# Altium schematic sheet RFID.SchDoc: RFID
size 420 x 297 mm; DrawnBy: Hung Vo; SheetNumber: 2; SheetTotal: 4; MasterProject: BTL TKHTN
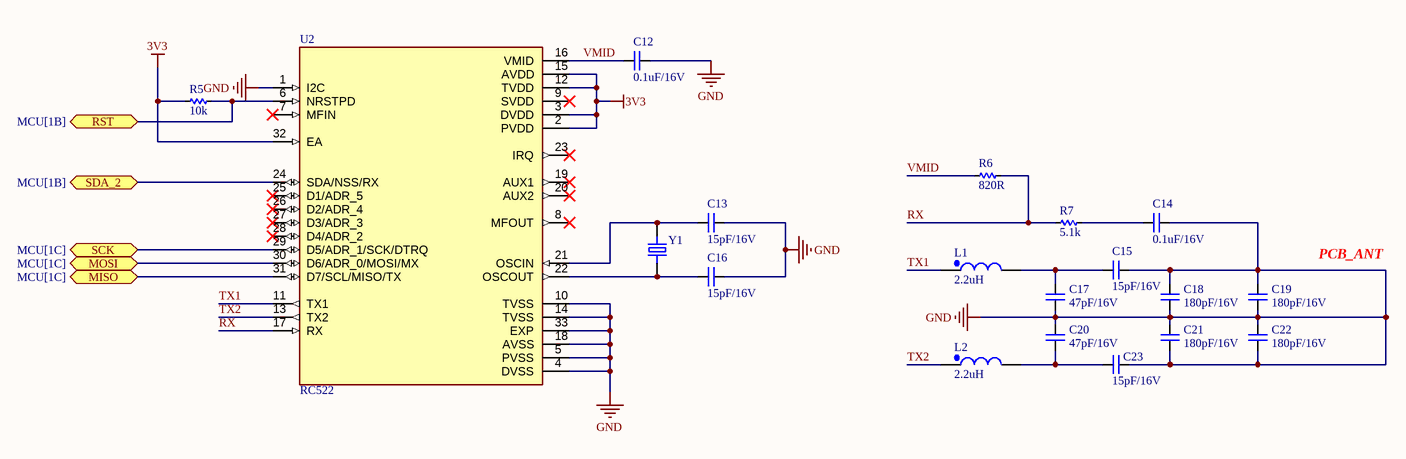
[diagram p0: RFID.SchDoc]

## Parts
C12  0.1uF/16V  [CAP_C_1608X80]
C13  15pF/16V  [CAP_C_1608X80]
C14  0.1uF/16V  [CAP_C_1608X80]
C15  15pF/16V  [CAP_C_1608X80]
C16  15pF/16V  [CAP_C_1608X80]
C17  47pF/16V  [CAP_C_1608X80]
C18  180pF/16V  [CAP_C_1608X80]
C19  180pF/16V  [CAP_C_1608X80]
C20  47pF/16V  [CAP_C_1608X80]
C21  180pF/16V  [CAP_C_1608X80]
C22  180pF/16V  [CAP_C_1608X80]
C23  15pF/16V  [CAP_C_1608X80]
L1  2.2uH  [IND_C_2012X65]
L2  2.2uH  [IND_C_2012X65]
R5  10k  [RES_C_1608X60]
R6  820R  [RES_C_1608X60]
R7  5.1k  [RES_C_1608X60]
U2  RC522  [QFN50P500X500X100-33N]
Y1  C1E-27.120-4-3030-R  [XTAL_C1E-27.120-4-3030-R]  (value not drawn)

## Ports
MISO (bidir, see MCU[1C]), MOSI (bidir, see MCU[1C]), RST (bidir, see MCU[1B]), SCK (bidir, see MCU[1C]), SDA_2 (bidir, see MCU[1B])

## Nets
3V3: R5.1 U2.2(PVDD) U2.3(DVDD) U2.12(TVDD) U2.15(AVDD) U2.32(EA)
GND: C12.2 C13.2 C14.2 C15.2 C16.2 C17.1 C18.1 C18.2 C19.1 C19.2 C20.2 C21.1 C21.2 C22.1 C22.2 C23.2 U2.1(I2C) U2.4(DVSS) U2.5(PVSS) U2.10(TVSS) U2.14(TVSS) U2.18(AVSS) U2.33(EXP)
MISO: U2.31(D7/SCL/MISO/TX) ; port MISO
MOSI: U2.30(D6/ADR_0/MOSI/MX) ; port MOSI
RST: R5.2 U2.6(NRSTPD) ; port RST
RX: R6.2 R7.1 U2.17(RX)
SCK: U2.29(D5/ADR_1/SCK/DTRQ) ; port SCK
SDA_2: U2.24(SDA/NSS/RX) ; port SDA_2
TX1: L1.1 U2.11(TX1)
TX2: L2.1 U2.13(TX2)
VMID: C12.1 R6.1 U2.16(VMID)
NetC13_1: C13.1 U2.21(OSCIN) Y1.3
NetC14_1: C14.1 R7.2
NetC15_1: C15.1 C17.2 L1.2
NetC16_1: C16.1 U2.22(OSCOUT) Y1.1
NetC20_1: C20.1 C23.1 L2.2

Not connected (* = marked no-connect by the designer): U2 7(MFIN)* 8(MFOUT)* 9(SVDD)* 19(AUX1)* 20(AUX2)* 23(IRQ)* 25(D1/ADR_5)* 26(D2/ADR_4)* 27(D3/ADR_3)* 28(D4/ADR_2)*

## Notes on the sheet
- PCB_ANT
- Sub-system:
- Project:
- Design by:
- Sheet title:
- Sheet
- of
- Checked by:
- Approved by:
- Doc No:
- Revision:
- Size:
- Date:
- A3

## Library data of the parts
C12-C23 = CAP_SMD: CAP_Chip; Value: 33pF
L1 L2 = _IND
R5-R7 = RES_SMD: RES
U2 = RC522: IC RFID READER 13.56MHZ 32HVQFN; MF: NXP USA Inc.; SnapEDA_Link: https://www.snapeda.com/parts/RC522/NXP+Semiconductors/view-part/?ref=snap; Package: VFQFN-32 NXP Semiconductors; Value: *; MP: RC522; Check_prices: https://www.snapeda.com/parts/RC522/NXP+Semiconductors/view-part/?ref=eda
Y1 = C1E-27.120-4-3030-R: CRYSTAL 27.1200MHZ 8PF SMD; Package: None; Price: None; Value: *; MP: C1E-27.120-4-3030-R; Availability: Unavailable